# EAGLE design PR5001 Mini Breakout Shield (EAGLE 6.4)
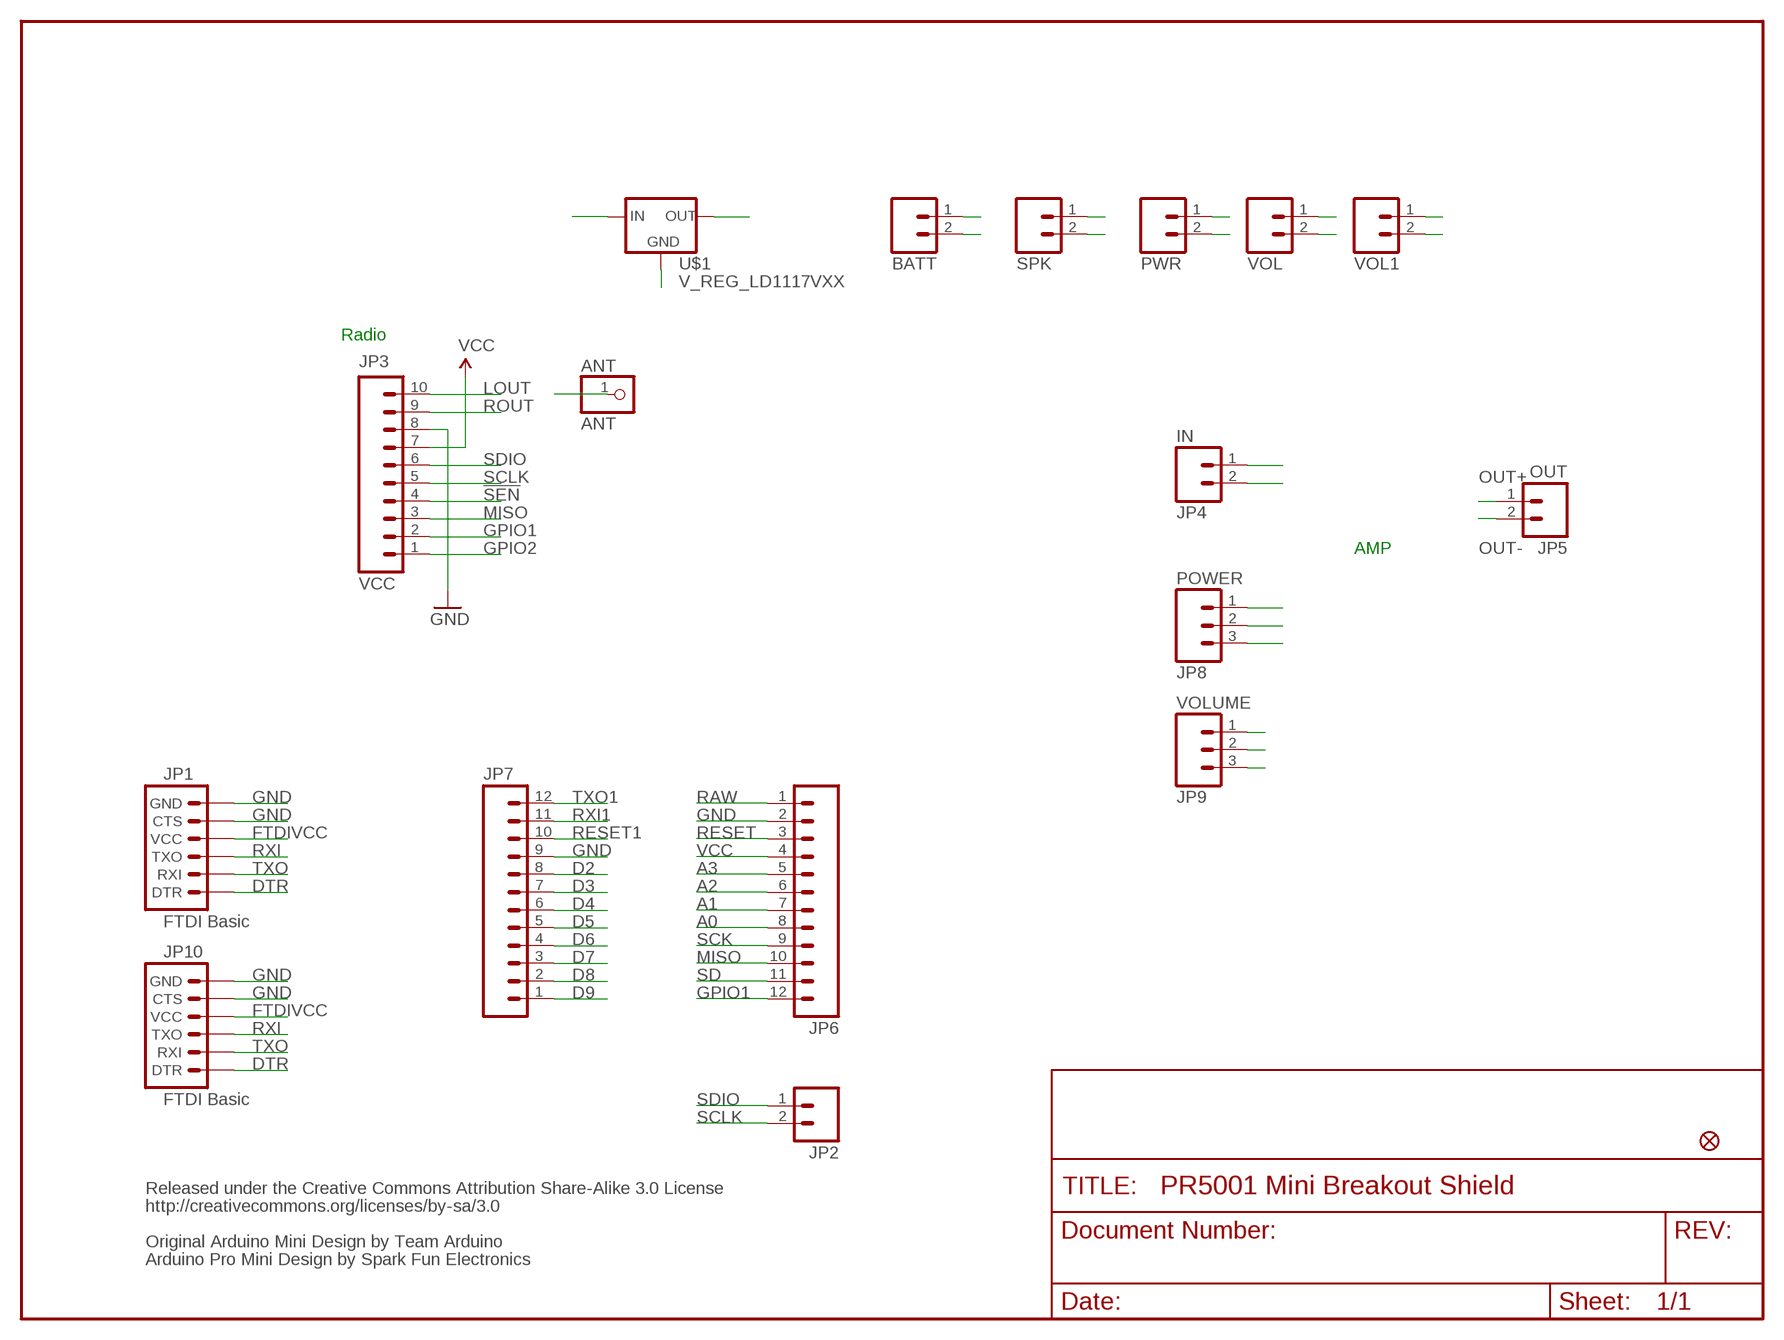
[diagram p0: schematic, sheet 1]

## Parts
ANT  ANT  PINHD-1X1  [1X01]
BATT  M02PTH  [1X02]
JP1  FTDI Basic  ARDUINO_SERIAL_PROGRAMPTH  [1X06]
JP2  M02PTH  [1X02]
JP3  VCC  M10"  [1X10]
JP4  IN  M02PTH  [1X02]
JP5  OUT  M02PTH  [1X02]
JP6  M12PTH  [1X12]
JP7  M12PTH  [1X12]
JP8  POWER  M03PTH  [1X03]
JP9  VOLUME  M03PTH  [1X03]
JP10  FTDI Basic  ARDUINO_SERIAL_PROGRAMPTH  [1X06]
PWR  M02PTH  [1X02]
SPK  M02PTH  [1X02]
U$1  V_REG_LD1117VXX  [78XXL]
U$4  FIDUCIAL1X2  [FIDUCIAL-1X2]
VOL  M02PTH  [1X02]
VOL1  M02PTH  [1X02]

## Nets
!SEN: JP3.4
A0: JP6.8
A1: JP6.7
A2: JP6.6
A3: JP6.5
ANT: ANT.1 VOL1.2
BATT+: BATT.1 PWR.1
D2: JP7.8
D3: JP7.7
D4: JP7.6
D5: JP7.5
D6: JP7.4
D7: JP7.3
D8: JP7.2
D9: JP7.1
DTR: JP1.1(DTR) JP10.1(DTR)
FTDIVCC: JP1.4(VCC) JP10.4(VCC)
GND [vcc]: BATT.2 JP1.5(CTS) JP1.6(GND) JP3.8 JP4.2 JP6.2 JP7.9 JP8.1 JP9.1 JP10.5(CTS) JP10.6(GND) U$1.IN(GND) VOL.1
GPIO1: JP3.2 JP6.12
GPIO2: JP3.1
IN: JP9.3 VOL1.1
LOUT: JP3.10 JP4.1
MISO: JP3.3 JP6.10
OPUT: JP9.2 VOL.2
OUT+: JP5.1 SPK.1
OUT-: JP5.2 SPK.2
POT+: PWR.2 U$1.OUT(IN)
RAW [vcc]: JP6.1
RESET: JP6.3
RESET1: JP7.10
ROUT: JP3.9
RXI: JP1.3(TXO) JP10.3(TXO)
RXI1: JP7.11
SCK: JP6.9
SCLK: JP2.2 JP3.5
SD [vcc]: JP6.11 JP8.3
SDIO: JP2.1 JP3.6
TXO: JP1.2(RXI) JP10.2(RXI)
TXO1: JP7.12
VCC: JP3.7 JP6.4 JP8.2 U$1.GND(OUT)

## Notes on the sheet
- Radio
- AMP
- Released under the Creative Commons Attribution Share-Alike 3.0 License
- http://creativecommons.org/licenses/by-sa/3.0
- Original Arduino Mini Design by Team Arduino
- Arduino Pro Mini Design by Spark Fun Electronics

## Library data of the parts
ANT = adafruit:PINHD-1X1: Pin header 1x1 for 0.1" spacing With round pins
BATT JP2 JP4 JP5 PWR SPK VOL VOL1 = SparkFun:M02: Header 2 Standard 2-pin 0.1" header. Use with straight break away headers (SKU : PRT-00116), right angle break away headers (PRT-00553), swiss pins (PRT-00743), machine pins (PRT-00117), and female headers (PRT-00115). Molex polarized connector foot print use with SKU : PRT-08233 with associated crimp pins and housings.
JP1 JP10 = SparkFun:ARDUINO_SERIAL_PROGRAM
JP3 = SparkFun-Connectors:M10: Header 10 Standard 10-pin 0.1" header. Use with straight break away headers (SKU : PRT-00116), right angle break away headers (PRT-00553), swiss pins (PRT-00743), machine pins (PRT-00117), and female headers (PRT-00115).
JP6 JP7 = SparkFun:M12: Header 12 Standard 12-pin 0.1" header. Use with straight break away headers (SKU : PRT-00116), right angle break away headers (PRT-00553), swiss pins (PRT-00743), machine pins (PRT-00117), and female headers (PRT-00115).
JP8 JP9 = SparkFun:M03: Header 3 Standard 3-pin 0.1" header. Use with straight break away headers (SKU : PRT-00116), right angle break away headers (PRT-00553), swiss pins (PRT-00743), machine pins (PRT-00117), and female headers (PRT-00115). Molex polarized connector foot print use with SKU : PRT-08232 with associated crimp pins and housings.
U$1 = SparkFun-PowerIC:V_REG_LD1117VXX: LD1117VXX voltage regulator. We carry the 3.3V version (COM-00526) in TO-220 package.
U$4 = SparkFun:FIDUCIAL: Fiducial Alignment Points Various fiducial points for machine vision alignment.

## Net classes
1 vcc: width 0.254 mm

## Board
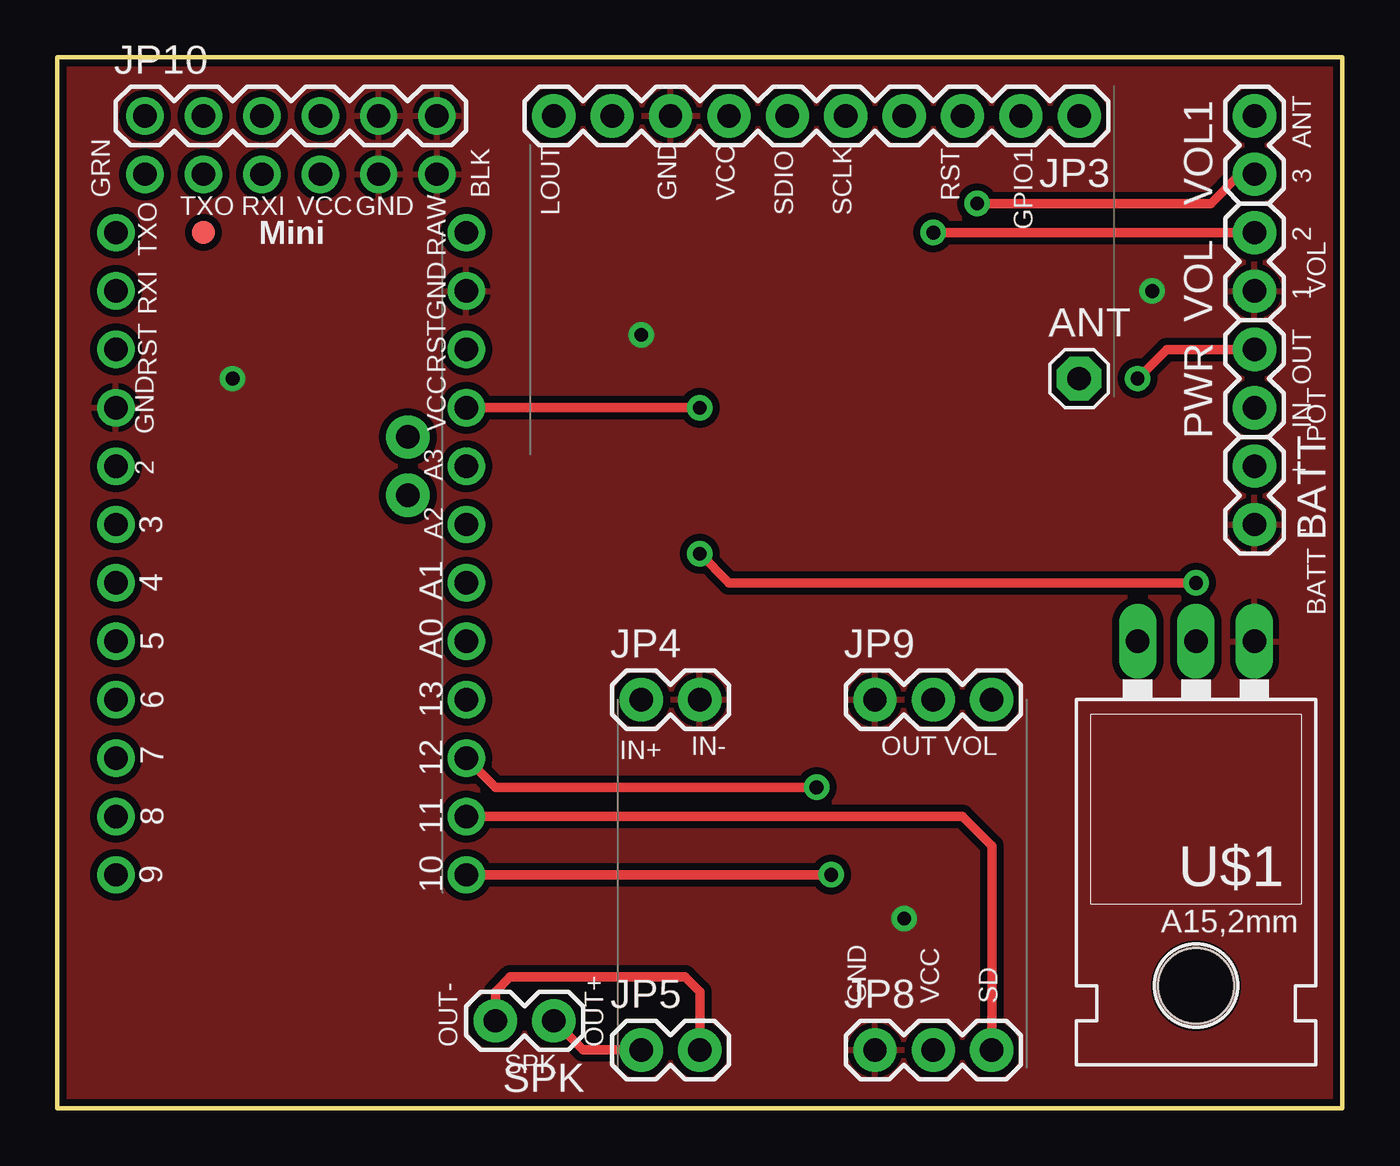
[diagram p1: board, top side]
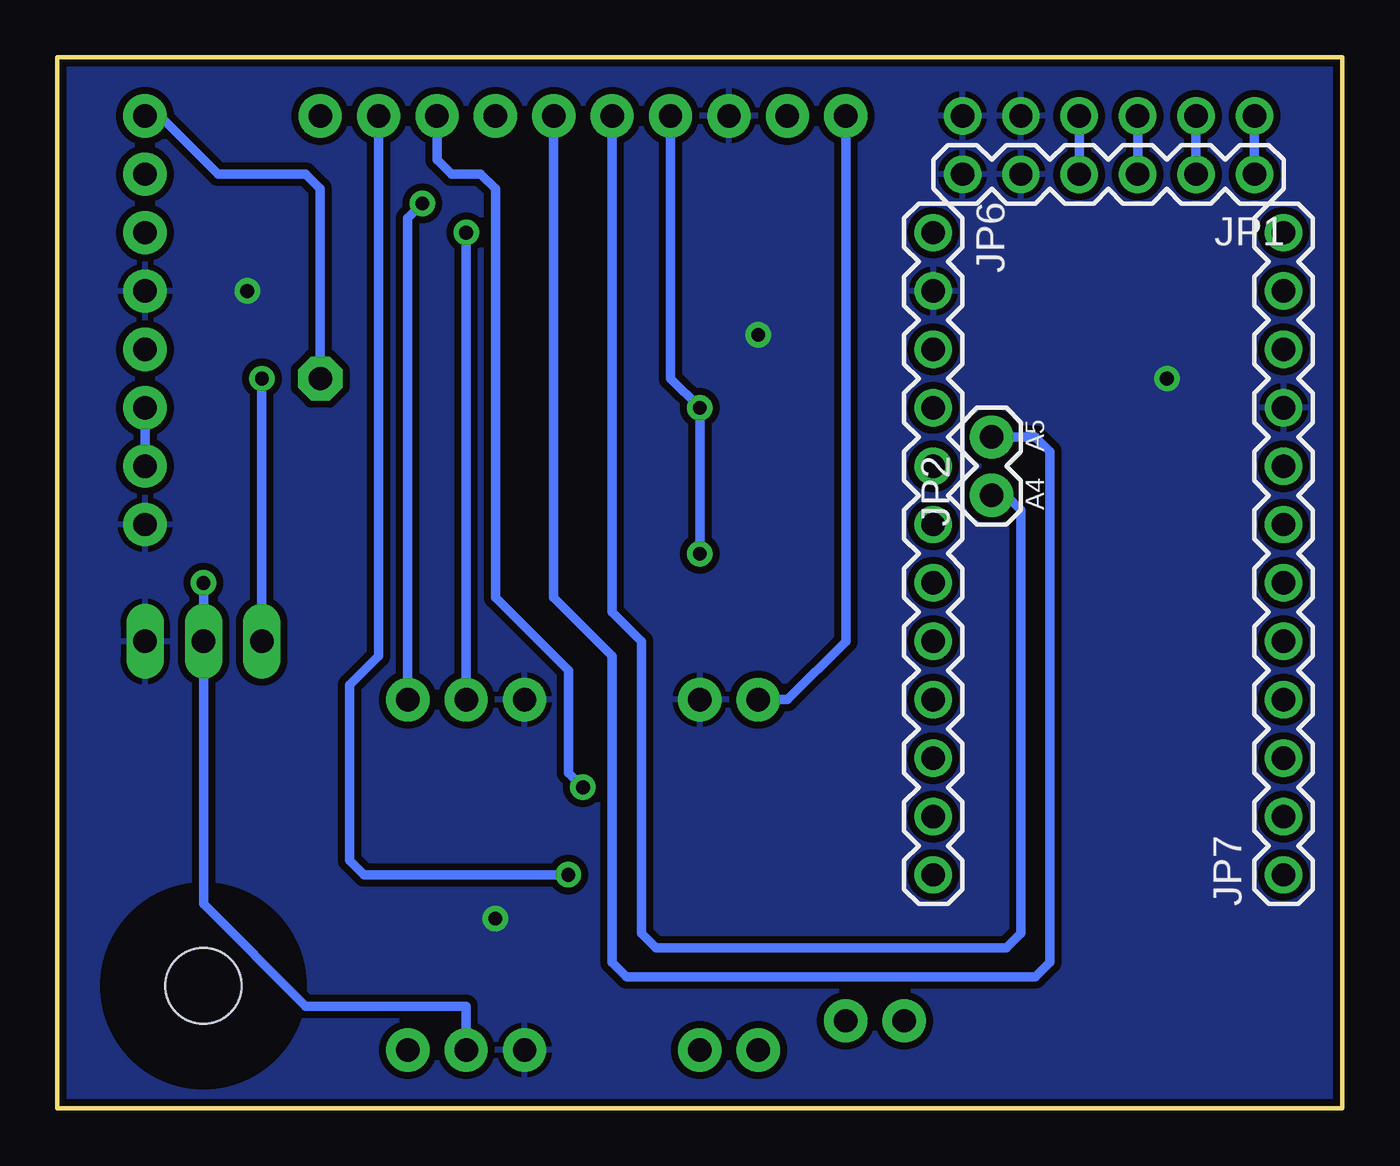
[diagram p2: board, bottom side, seen from below]

Size 55.88 x 45.72 mm. Coordinates in mm from the lower left corner, seen from the top.
Outline: 0,45.72 0,0 55.88,0 55.88,45.72 0,45.72
Copper layers (1*16): Top 0.035mm / dielectric 1.5mm / Bottom 0.035mm
Design rules "SparkFun *": minimum track width 8mil, minimum drill 20mil, track to track 8mil, track to pad 8mil, pad to pad 8mil, via to via 8mil, smd to smd 8mil, copper to edge 10mil, drill to drill 8mil, minimum pad ring 12mil, minimum via ring 10mil, stop-mask expansion 4mil, vias tented up to drill 20mil, thermal gap 10mil

### Footprints (pad centres in the part's own frame; a part is rotated, then mirrored left to right if it is on the bottom)
1X01 = drill 1.016 pad 1.93 octagon: 1 0,0
1X02 = drill 1.016 pad 1.88: 1 0,0; 2 2.54,0
1X06 = drill 1.016: 1 0,0; 2 2.54,0; 3 5.08,0; 4 7.62,0; 5 10.16,0; 6 12.7,0
1X10 = drill 1.016 pad 1.88: 1 0,0; 2 2.54,0; 3 5.08,0; 4 7.62,0; 5 10.16,0; 6 12.7,0; 7 15.24,0; 8 17.78,0; 9 20.32,0; 10 22.86,0
1X12 = drill 1.016: 1 0,0; 2 2.54,0; 3 5.08,0; 4 7.62,0; 5 10.16,0; 6 12.7,0; 7 15.24,0; 8 17.78,0; 9 20.32,0; 10 22.86,0; 11 25.4,0; 12 27.94,0
1X03 = drill 1.016 pad 1.88: 1 0,0; 2 2.54,0; 3 5.08,0
78XXL = drill 1.016 long: GND 0,-3.81; IN -2.54,-3.81; OUT 2.54,-3.81 | hole 3.302: 0,11.176
FIDUCIAL-1X2 = smd 1 x 1: 1 0,0

### Placement (x,y rotation side)
ANT  44.45,31.75 0 top
BATT  52.07,27.94 270 top
JP1  3.81,40.64 180 bottom
JP2  15.24,26.67 90 bottom
JP3  44.45,43.18 180 top
JP4  25.4,17.78 0 top
JP5  25.4,2.54 0 top
JP6  17.78,38.1 270 bottom
JP7  2.54,10.16 90 bottom
JP8  35.56,2.54 0 top
JP9  35.56,17.78 0 top
JP10  3.81,43.18 0 top
PWR  52.07,30.48 90 top
SPK  21.59,3.81 180 top
U$1  49.53,16.51 180 top
U$4  6.35,38.1 0 top
VOL  52.07,35.56 90 top
VOL1  52.07,40.64 90 top

### Tracks (layer width: path | path; a pad name or v marks a point on that pad's centre or on a via)
ANT
  Top 0.406: 51.44,43.18 VOL1.2
  Bottom 0.406: ANT.1 44.45,40.01 45.09,40.64 48.9,40.64 51.44,43.18 VOL1.2
BATT+
  Bottom 0.406: BATT.1 PWR.1
DTR
  Bottom 0.406: JP10.1 JP1.1
FTDIVCC
  Bottom 0.406: JP10.4 JP1.4
GND  (via drill 0.6)
  other vias: 36.83,8.26 47.62,35.56 25.4,33.66 7.62,31.75
  pour Top (isolate 0.305): 0,45.72 55.88,45.72 55.88,0 0,0
  pour Bottom (isolate 0.305): 0,45.72 55.88,45.72 55.88,0 0,0
GPIO1  (via drill 0.6)
  Top 0.406: v33.66,10.16 JP6.12
  Bottom 0.406: JP3.2 41.91,19.68 43.18,18.41 43.18,10.79 42.55,10.16 v33.66,10.16
IN  (via drill 0.6)
  Top 0.406: v40.01,39.37 50.16,39.37 51.44,40.64 VOL1.1
  Bottom 0.406: JP9.3 40.64,38.73 v40.01,39.37
LOUT
  Bottom 0.406: JP3.10 21.59,20.32 24.13,17.78 JP4.1
MISO  (via drill 0.6)
  Top 0.406: v33.02,13.97 19.05,13.97 JP6.10
  Bottom 0.406: JP3.3 39.37,41.27 38.73,40.64 37.47,40.64 36.83,40.01 36.83,22.23 33.66,19.05 33.66,14.61 v33.02,13.97
OPUT  (via drill 0.6)
  Top 0.406: v38.1,38.1 VOL.2
  Bottom 0.406: JP9.2 v38.1,38.1
OUT+
  Top 0.406: JP5.1 22.86,2.54 SPK.1
OUT-
  Top 0.406: JP5.2 27.94,5.08 27.3,5.71 19.68,5.71 19.05,5.08 SPK.2
POT+  (via drill 0.6)
  Top 0.406: PWR.2 48.26,33.02 v46.99,31.75
  Bottom 0.406: v46.99,31.75 U$1.OUT
RXI
  Bottom 0.406: JP10.3 JP1.3
SCLK
  Bottom 0.406: JP2.2 13.34,29.21 12.7,28.57 12.7,6.35 13.34,5.71 31.11,5.71 31.75,6.35 31.75,19.68 34.29,22.23 JP3.5
SD
  Top 0.406: JP6.11 39.37,12.7 40.64,11.43 JP8.3
SDIO
  Bottom 0.406: JP3.6 31.75,21.59 30.48,20.32 30.48,7.62 29.84,6.99 14.61,6.99 13.97,7.62 13.97,26.04 14.61,26.67 JP2.1
TXO
  Bottom 0.406: JP10.2 JP1.2
VCC  (via drill 0.6)
  Top 0.406: v27.94,30.48 JP6.4 | v49.53,22.86 29.21,22.86 v27.94,24.13
  Bottom 0.406: JP3.7 29.21,31.75 v27.94,30.48 v27.94,24.13 | JP8.2 38.1,4.45 45.09,4.45 49.53,8.89 U$1.GND v49.53,22.86

### Text on the board
tPlace: ANT | 3 | GRN | BLK | TXO | RXI | VCC | GND | LOUT | GND | VCC | SDIO | SCLK | RST | Mini | GPIO1 | 2 | VOL | TXO | RAW | 1 | RXI | GND | OUT | RST | RST | IN | POT | GND | VCC | 2 | + | A3 | - | 3 | A2 | BATT | 4 | A1 | 5 | A0 | 6 | 13 | IN+ | 7 | IN- | OUT VOL | 12 | 8 | 11 | 9 | 10 | GND | VCC | SD | OUT- | OUT+ | SPK
bPlace: A5 | A4
tValues: Tent Vias! | Arduino Wee v1.3